# Altium schematic sheet MAGI'sDIPBoard-MBH.SchDoc
size A4
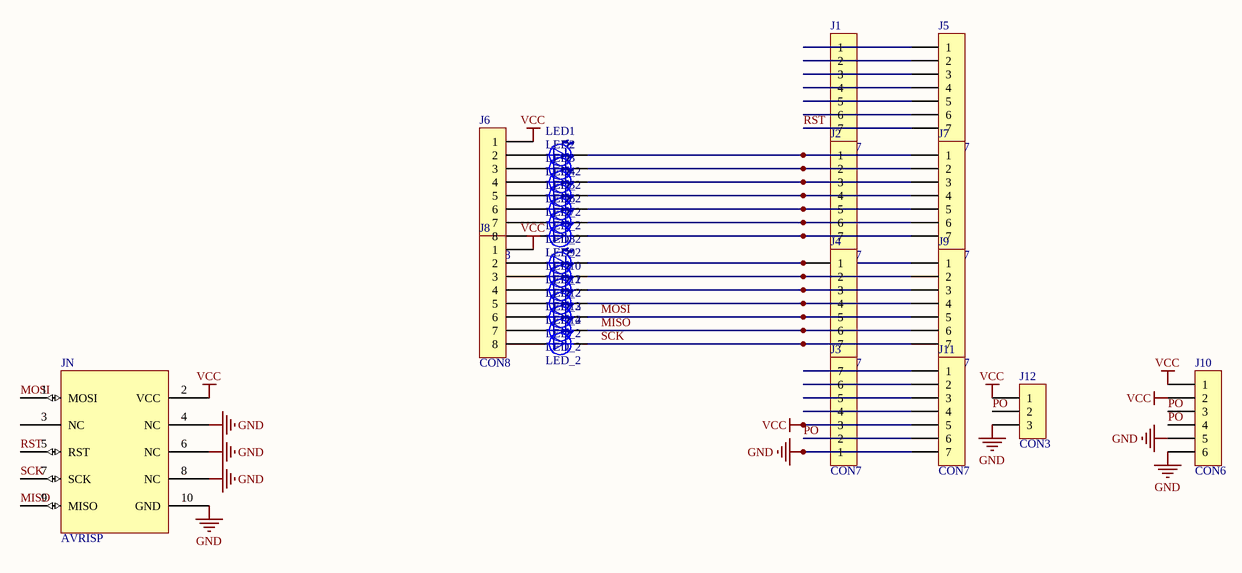
[diagram p0: MAGI'sDIPBoard-MBH.SchDoc]

## Parts
J1  CON7  [CON7]
J2  CON7  [CON7]
J3  CON7  [CON7]
J4  CON7  [CON7]
J5  CON7  [CON7]
J6  CON8  [CON8]
J7  CON7  [CON7]
J8  CON8  [CON8]
J9  CON7  [CON7]
J10  CON6  [CON6]
J11  CON7  [CON7]
J12  CON3  [CON3]
JN  AVRISP  [AVRISP]
LED1  LED_2  [LED5]
LED2  LED_2  [LED5]
LED3  LED_2  [LED5]
LED4  LED_2  [LED5]
LED5  LED_2  [LED5]
LED6  LED_2  [LED5]
LED7  LED_2  [LED5]
LED8  LED_2  [LED5]
LED9  LED_2  [LED5]
LED10  LED_2  [LED5]
LED11  LED_2  [LED5]
LED12  LED_2  [LED5]
LED13  LED_2  [LED5]
LED14  LED_2  [LED5]

## Nets
GND: J3.1 J10.5 J10.6 J11.7 J12.3 JN.4(NC) JN.6(NC) JN.8(NC) JN.10(GND)
VCC: J3.3 J6.1 J8.1 J10.1 J10.2 J11.5 J12.1 JN.2(VCC)
MISO: J4.6 J9.6 JN.9(MISO) LED13.K
MOSI: J4.5 J9.5 JN.1(MOSI) LED12.K
PO: J3.2 J10.3 J10.4 J11.6 J12.2
RST: J1.7 J5.7 JN.5(RST)
SCK: J4.7 J9.7 JN.7(SCK) LED14.K
NetJ1_1: J1.1 J5.1
NetJ1_2: J1.2 J5.2
NetJ1_3: J1.3 J5.3
NetJ1_4: J1.4 J5.4
NetJ1_5: J1.5 J5.5
NetJ1_6: J1.6 J5.6
NetJ2_1: J2.1 J7.1 LED1.K
NetJ2_2: J2.2 J7.2 LED2.K
NetJ2_3: J2.3 J7.3 LED3.K
NetJ2_4: J2.4 J7.4 LED4.K
NetJ2_5: J2.5 J7.5 LED5.K
NetJ2_6: J2.6 J7.6 LED6.K
NetJ2_7: J2.7 J7.7 LED7.K
NetJ3_4: J3.4 J11.4
NetJ3_5: J3.5 J11.3
NetJ3_6: J3.6 J11.2
NetJ3_7: J3.7 J11.1
NetJ4_1: J4.1 J9.1 LED8.K
NetJ4_2: J4.2 J9.2 LED9.K
NetJ4_3: J4.3 J9.3 LED10.K
NetJ4_4: J4.4 J9.4 LED11.K
NetJ6_2: J6.2 LED1.A
NetJ6_3: J6.3 LED2.A
NetJ6_4: J6.4 LED3.A
NetJ6_5: J6.5 LED4.A
NetJ6_6: J6.6 LED5.A
NetJ6_7: J6.7 LED6.A
NetJ6_8: J6.8 LED7.A
NetJ8_2: J8.2 LED8.A
NetJ8_3: J8.3 LED9.A
NetJ8_4: J8.4 LED10.A
NetJ8_5: J8.5 LED11.A
NetJ8_6: J8.6 LED12.A
NetJ8_7: J8.7 LED13.A
NetJ8_8: J8.8 LED14.A

Not connected (* = marked no-connect by the designer): JN 3(NC)

## Library data of the parts
J1-J5 J7 J9 J11 = CON7: Connector
J6 J8 = CON8: Connector
J10 = CON6: Connector
J12 = CON3: Connector